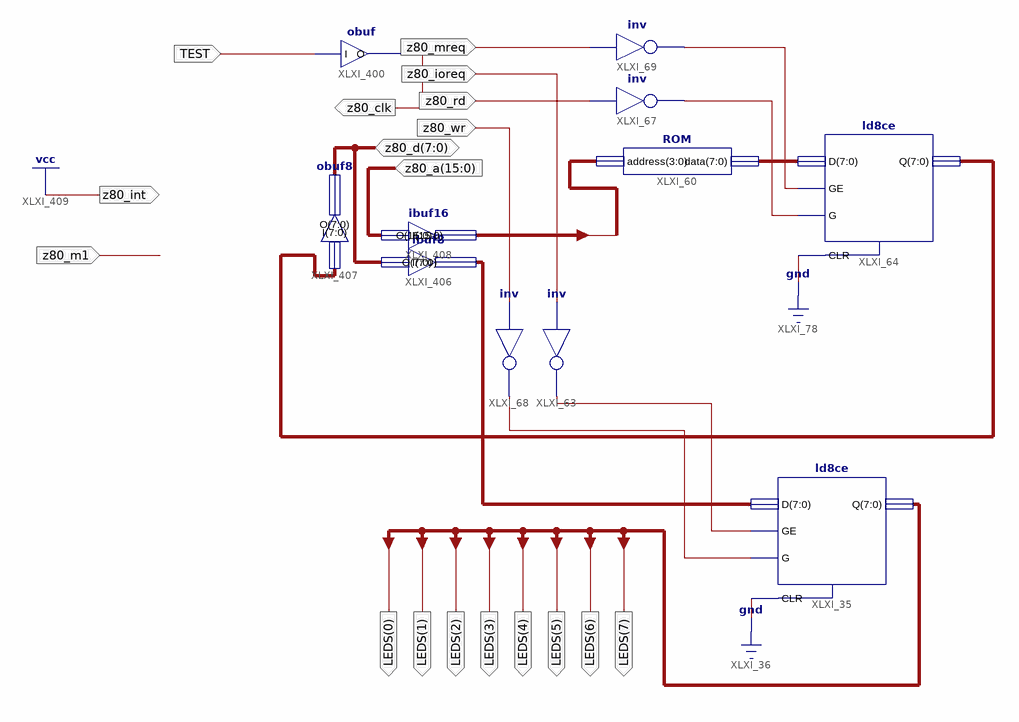
[diagram p0: schematic sheet 1]
// Xilinx ISE schematic ZAP_read_only_external_z80.sch (spartan3) as structural Verilog: 11 symbols, 18 ports
module ZAP_read_only_external_z80 (
  input  TEST,
  input  z80_ioreq,
  input  z80_rd,
  input  z80_wr,
  input  z80_mreq,
  input  [15:0] z80_a,
  input  z80_m1,
  inout  [7:0] z80_d,
  output [7:0] LEDS,
  output z80_clk,
  output z80_int
);

  wire XLXN_221, XLXN_230, XLXN_274, XLXN_275;
  wire [7:0] XLXN_218, XLXN_222, XLXN_276;
  wire [15:0] ADDRESSES;

  ld8ce XLXI_64 (
    .CLR(1'b0),
    .D({XLXN_222[0], XLXN_222[1], XLXN_222[2], XLXN_222[3], XLXN_222[4], XLXN_222[5], XLXN_222[6], XLXN_222[7]}),
    .G(XLXN_275), .GE(XLXN_274), .Q(XLXN_276));
  not XLXI_67 (XLXN_275, z80_rd);
  not XLXI_69 (XLXN_274, z80_mreq);
  not XLXI_63 (XLXN_221, z80_ioreq);
  not XLXI_68 (XLXN_230, z80_wr);
  ROM XLXI_60 (
    .address(ADDRESSES[3:0]),
    .data({XLXN_222[0], XLXN_222[1], XLXN_222[2], XLXN_222[3], XLXN_222[4], XLXN_222[5], XLXN_222[6], XLXN_222[7]}));
  ld8ce XLXI_35 (.CLR(1'b0), .D(XLXN_218), .G(XLXN_230), .GE(XLXN_221), .Q(LEDS));
  obuf8 XLXI_407 (.I(XLXN_276), .O(z80_d));
  ibuf8 XLXI_406 (.I(z80_d), .O(XLXN_218));
  ibuf16 XLXI_408 (.I(z80_a), .O(ADDRESSES));
  obuf XLXI_400 (.I(TEST), .O(z80_clk));

  assign z80_int = 1'b1;
endmodule
